# EAGLE design tdt_ysplitter (EAGLE 8.1.0)
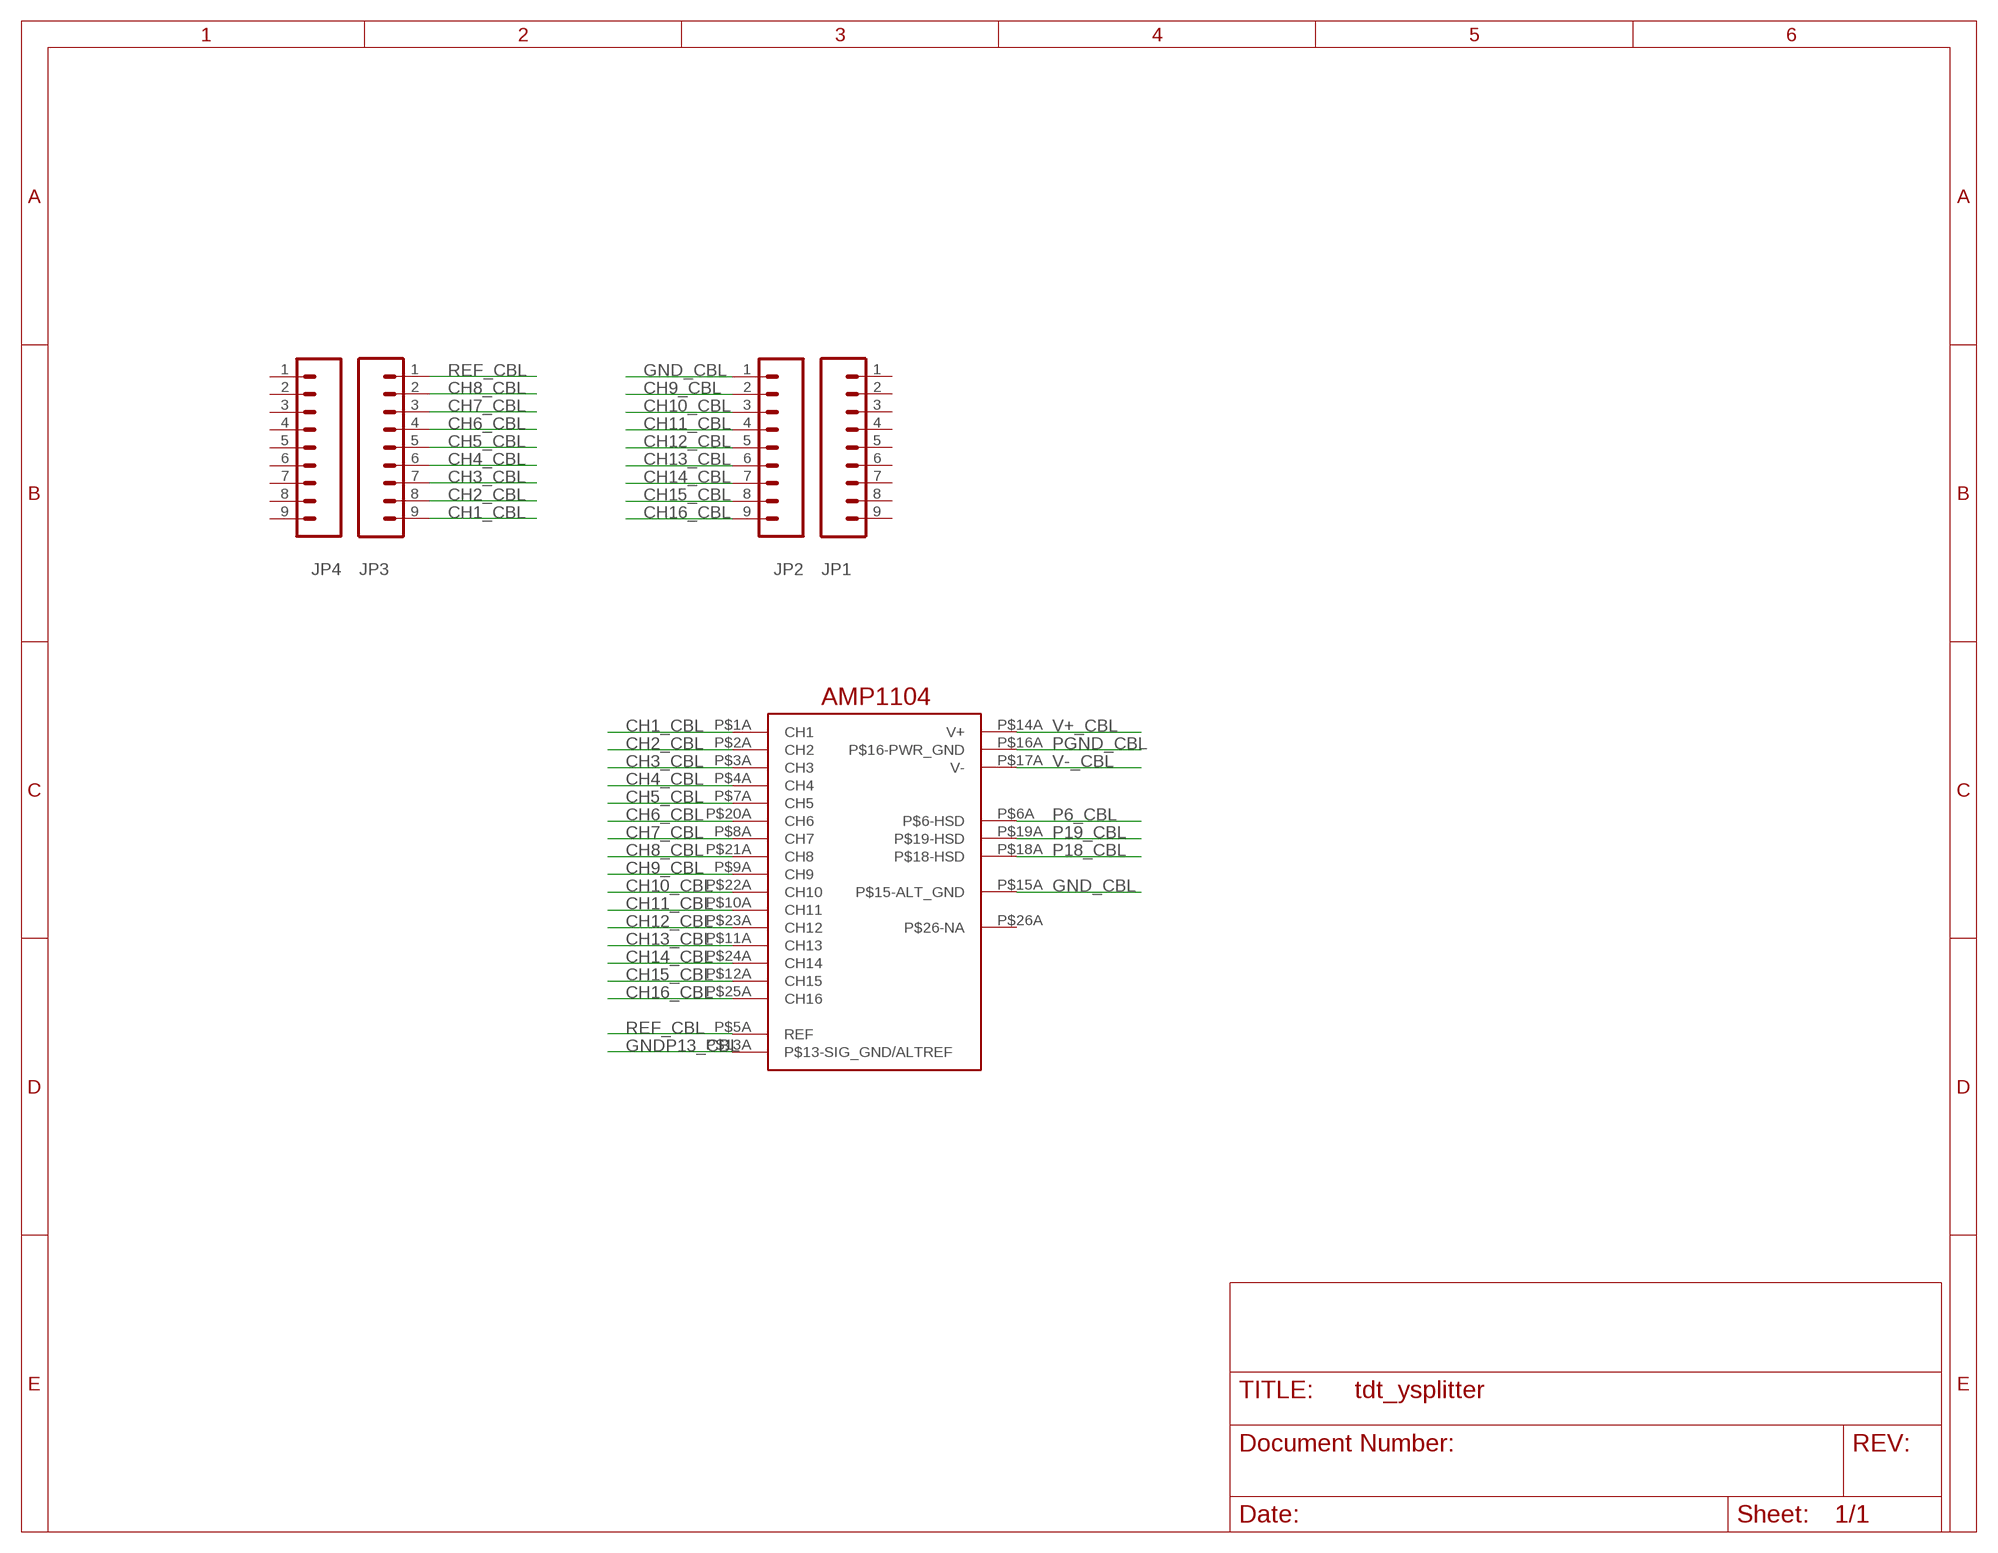
[diagram p0: schematic, sheet 1]

## Parts
JP1  M09  [1X09]
JP2  M09  [1X09]
JP3  M09  [1X09]
JP4  M09  [1X09]
U$3  AMP1104  [AMP1104]

## Nets
CH1_CBL: JP3.9 U$3.P$1A(CH1)
CH2_CBL: JP3.8 U$3.P$2A(CH2)
CH3_CBL: JP3.7 U$3.P$3A(CH3)
CH4_CBL: JP3.6 U$3.P$4A(CH4)
CH5_CBL: JP3.5 U$3.P$7A(CH5)
CH6_CBL: JP3.4 U$3.P$20A(CH6)
CH7_CBL: JP3.3 U$3.P$8A(CH7)
CH8_CBL: JP3.2 U$3.P$21A(CH8)
CH9_CBL: JP2.2 U$3.P$9A(CH9)
CH10_CBL: JP2.3 U$3.P$22A(CH10)
CH11_CBL: JP2.4 U$3.P$10A(CH11)
CH12_CBL: JP2.5 U$3.P$23A(CH12)
CH13_CBL: JP2.6 U$3.P$11A(CH13)
CH14_CBL: JP2.7 U$3.P$24A(CH14)
CH15_CBL: JP2.8 U$3.P$12A(CH15)
CH16_CBL: JP2.9 U$3.P$25A(CH16)
GND_CBL: JP2.1 U$3.P$15A(P$15-ALT_GND)
GNDP13_CBL: U$3.P$13A(P$13-SIG_GND/ALTREF)
P6_CBL: U$3.P$6A(P$6-HSD)
P18_CBL: U$3.P$18A(P$18-HSD)
P19_CBL: U$3.P$19A(P$19-HSD)
PGND_CBL: U$3.P$16A(P$16-PWR_GND)
REF_CBL: JP3.1 U$3.P$5A(REF)
V+_CBL: U$3.P$14A(V+)
V-_CBL: U$3.P$17A(V-)
Unconnected: JP1.1 JP1.2 JP1.3 JP1.4 JP1.5 JP1.6 JP1.7 JP1.8 JP1.9 JP4.1 JP4.2 JP4.3 JP4.4 JP4.5 JP4.6 JP4.7 JP4.8 JP4.9 U$3.P$26A(P$26-NA)

## Library data of the parts
JP1-JP4 = SparkFun-Connectors:M09: Header 9 Standard 9-pin 0.1" header. Use with straight break away headers (SKU : PRT-00116), right angle break away headers (PRT-00553), swiss pins (PRT-00743), machine pins (PRT-00117), and female headers (PRT-00115).
U$3 = TDTCableConnector:AMP1104

## Board
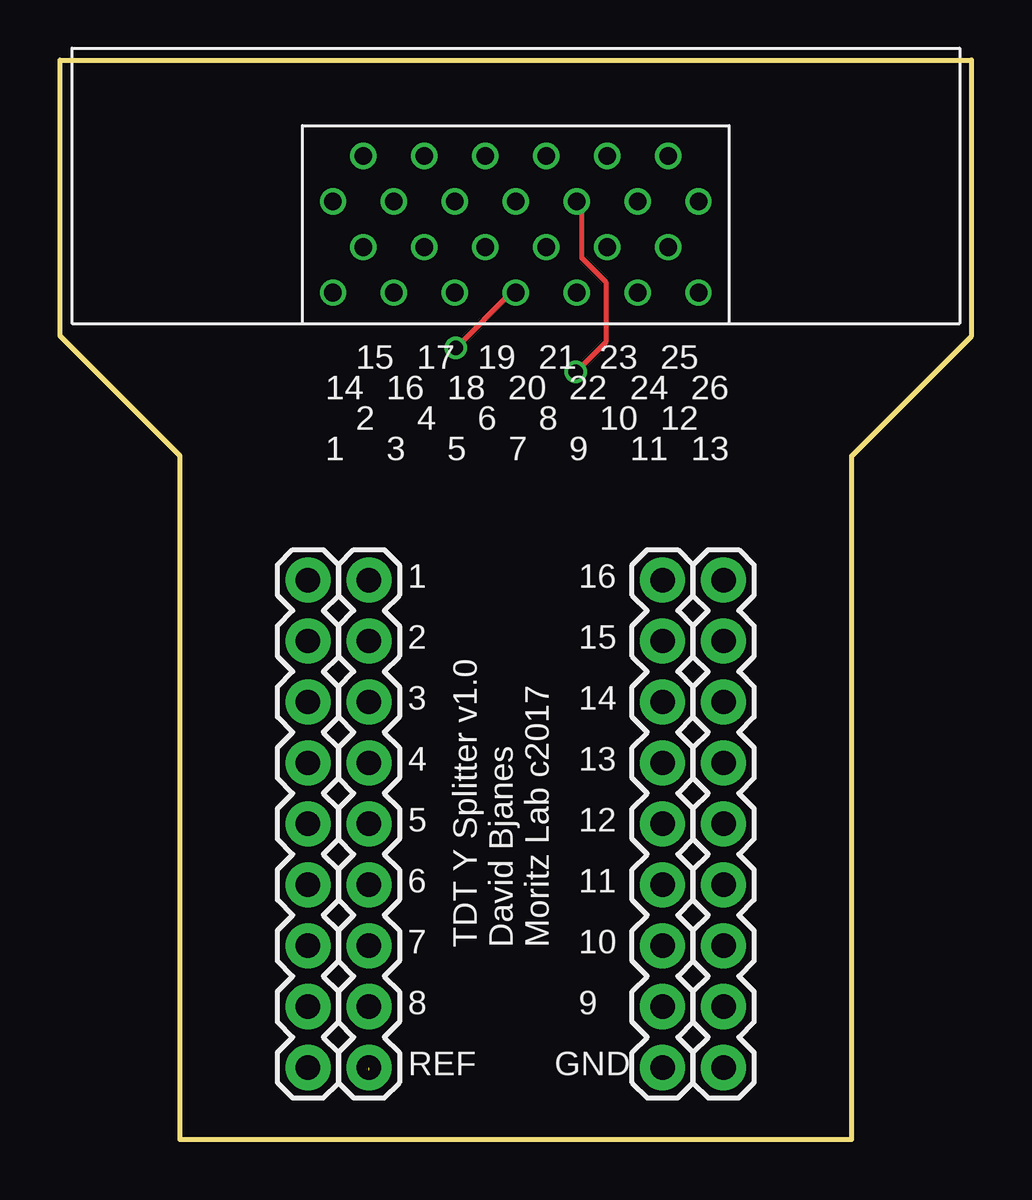
[diagram p1: board, top side]
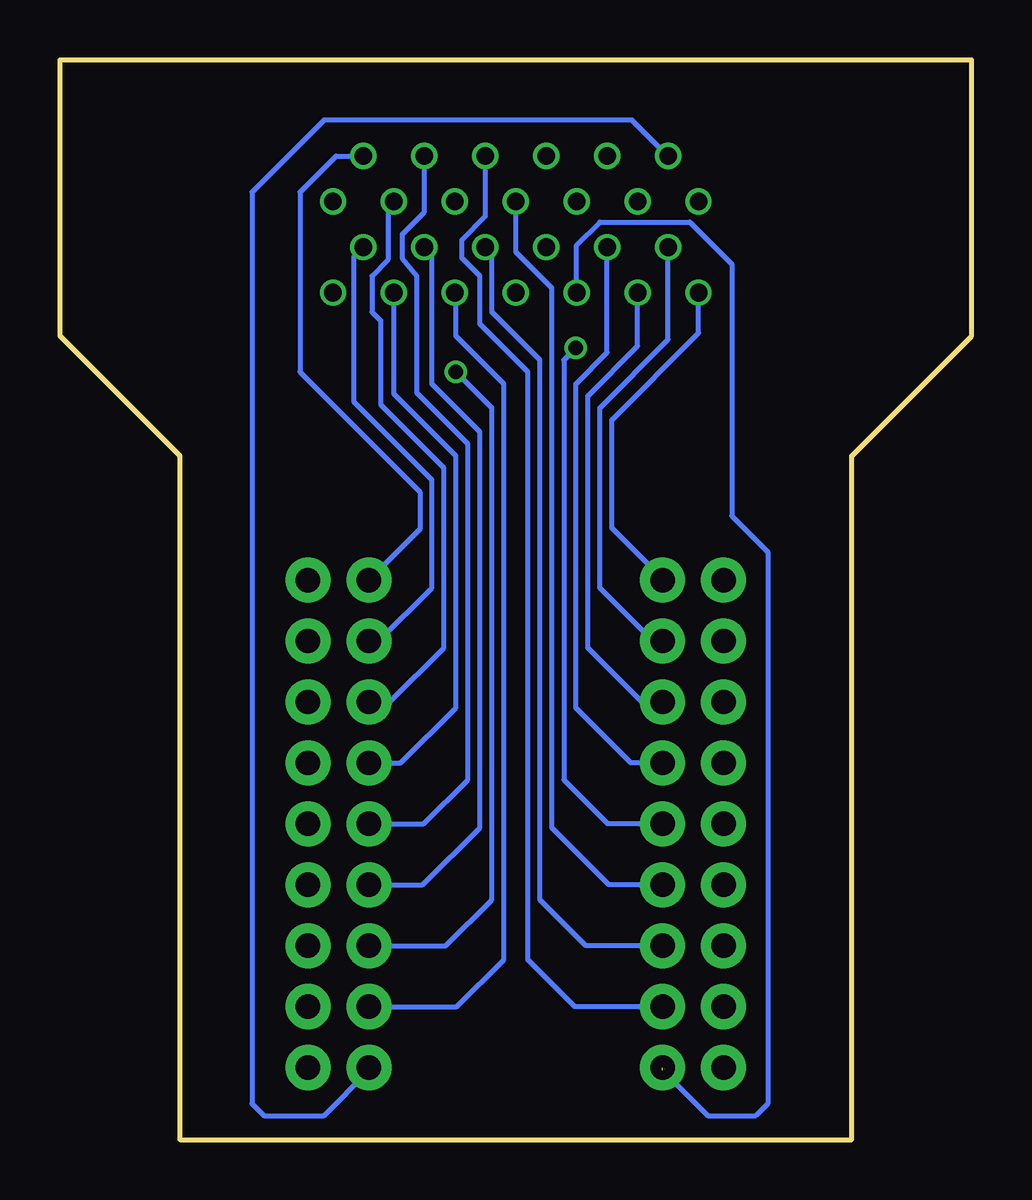
[diagram p2: board, bottom side, seen from below]

Size 38 x 45 mm. Coordinates in mm from the lower left corner, seen from the top.
Outline: 33,0 33,28.5 38,33.5 38,45 0,45 0,33.5 5,28.5 5,0 33,0
Copper layers (1*16): Top 0.0356mm / dielectric 1.5011mm / Bottom 0.0356mm
Design rules "oshpark-2layer *": minimum track width 6mil, minimum drill 13mil, track to track 6mil, track to pad 6mil, pad to pad 6mil, via to via 6mil, smd to smd 6mil, copper to edge 15mil, drill to drill 6mil, minimum pad ring 7mil, minimum via ring 7mil, stop-mask expansion 2.5mil, vias tented up to drill 0mil, thermal gap 10mil

### Footprints (pad centres in the part's own frame; a part is rotated, then mirrored left to right if it is on the bottom)
1X09 = drill 1.016 pad 1.88: 1 0,0; 2 2.54,0; 3 5.08,0; 4 7.62,0; 5 10.16,0; 6 12.7,0; 7 15.24,0; 8 17.78,0; 9 20.32,0
AMP1104 = drill 0.737 pad 1.092: P$1A -7.62,-5.7; P$2A -6.35,-3.8; P$3A -5.08,-5.7; P$4A -3.81,-3.8; P$5A -2.54,-5.7; P$6A -1.27,-3.8; P$7A 0,-5.7; P$8A 1.27,-3.8; P$9A 2.54,-5.7; P$10A 3.81,-3.8; P$11A 5.08,-5.7; P$12A 6.35,-3.8; P$13A 7.62,-5.7; P$14A -7.62,-1.9; P$15A -6.35,0; P$16A -5.08,-1.9; P$17A -3.81,0; P$18A -2.54,-1.9; P$19A -1.27,0; P$20A 0,-1.9; P$21A 1.27,0; P$22A 2.54,-1.9; P$23A 3.81,0; P$24A 5.08,-1.9; P$25A 6.35,0; P$26A 7.62,-1.9

### Placement (x,y rotation side)
JP1  27.66,3 90 top
JP2  25.12,3 90 top
JP3  12.88,3 90 top
JP4  10.34,3 90 top
U$3  19,41 0 top

### Tracks (layer width: path | path; a pad name or v marks a point on that pad's centre or on a via)
CH1_CBL
  Bottom 0.203: JP3.9 12.82,23.32 15,25.5 15,30 11.38,33.62 U$3.P$1A
CH2_CBL
  Bottom 0.203: JP3.8 13.28,20.78 15.5,23 15.5,30.5 12.65,33.35 U$3.P$2A
CH3_CBL
  Bottom 0.203: JP3.7 13.74,18.24 16,20.5 16,31 13.92,33.08 U$3.P$3A
CH4_CBL
  Bottom 0.203: JP3.6 14.2,15.7 16.5,18 16.5,31.5 15.19,32.81 U$3.P$4A
CH5_CBL  (via drill 0.6)
  Top 0.203: U$3.P$7A 18.8,35.3 v16.5,33
  Bottom 0.203: JP3.5 15.16,13.16 17,15 17,32.5 v16.5,33
CH6_CBL
  Bottom 0.203: JP3.4 15.12,10.62 17.5,13 17.5,35.5 19,37 U$3.P$20A
CH7_CBL
  Bottom 0.203: JP3.3 16.08,8.08 18,10 18,32.5 20,34.5 20,36.93 U$3.P$8A
CH8_CBL
  Bottom 0.203: JP3.2 16.54,5.54 18.5,7.5 18.5,32 20.5,34 20.5,36 21.25,36.75 21.25,37.5 20.27,38.48 U$3.P$21A
CH9_CBL
  Bottom 0.203: JP2.2 21.46,5.54 19.5,7.5 19.5,31.5 21.5,33.5 21.5,35.26 U$3.P$9A
CH10_CBL  (via drill 0.6)
  Top 0.203: U$3.P$22A 21.75,38.89 21.75,36.75 22.75,35.75 22.75,33.25 v21.5,32
  Bottom 0.203: JP2.3 21.92,8.08 20,10 20,30.5 v21.5,32
CH11_CBL
  Bottom 0.203: JP2.4 22.88,10.62 20.5,13 20.5,29.5 22.5,31.5 22.5,36.89 U$3.P$10A
CH12_CBL
  Bottom 0.203: JP2.5 22.84,13.16 21,15 21,29 23.12,31.12 23.12,36 23.72,36.72 23.72,37.75 22.81,38.66 U$3.P$23A
CH13_CBL
  Bottom 0.203: JP2.6 23.8,15.7 21.5,18 21.5,28.5 24.08,31.08 U$3.P$11A
CH14_CBL
  Bottom 0.203: JP2.7 24.26,18.24 22,20.5 22,28 24.62,30.62 24.62,34.12 25,34.5 25,36 24.33,36.67 24.33,38.9 24.08,39.15 U$3.P$24A
CH15_CBL
  Bottom 0.203: JP2.8 24.72,20.78 22.5,23 22.5,27.5 25.75,30.75 25.75,36.8 U$3.P$12A
CH16_CBL
  Bottom 0.203: U$3.P$25A 26.5,41 28,39.5 28,32 23,27 23,25.44 JP2.9
GND_CBL
  Bottom 0.203: U$3.P$15A 14.15,42.5 27,42.5 30,39.5 30,1.5 29.5,1 27,1 25.12,2.88 JP2.1
REF_CBL  (1 unrouted)
  Bottom 0.203: 12.88,2.88 11,1 9,1 8.5,1.5 8.5,24.5 10,26 10,36.5 11.75,38.25 15.5,38.25 16.46,37.29 U$3.P$5A

### Text on the board
tPlace: 1 | 16 | 2 | 15 | 3 | 14 | 4 | 13 | 5 | 12 | 6 | 11 | 7 | 10 | 8 | 9 | REF | GND
tNames: TDT Y Splitter v1.0 / David Bjanes / Moritz Lab c2017